# EAGLE board projectVGA (EAGLE 4.16), part 1 of 2
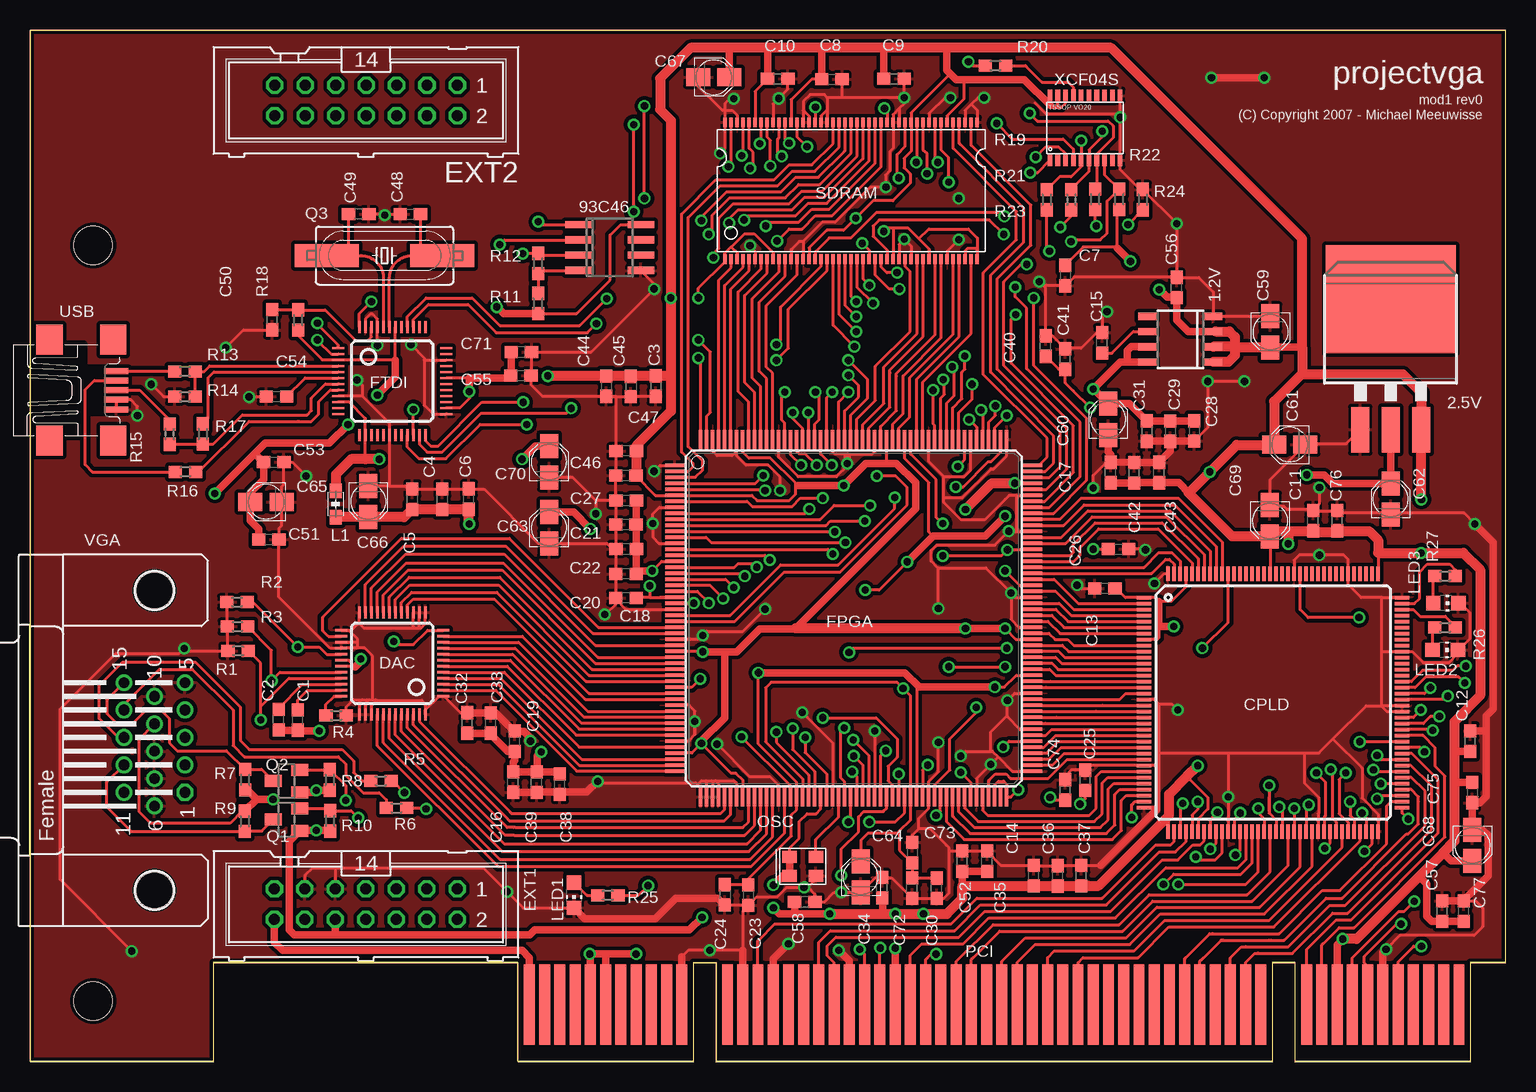
[diagram p5: board, top side]
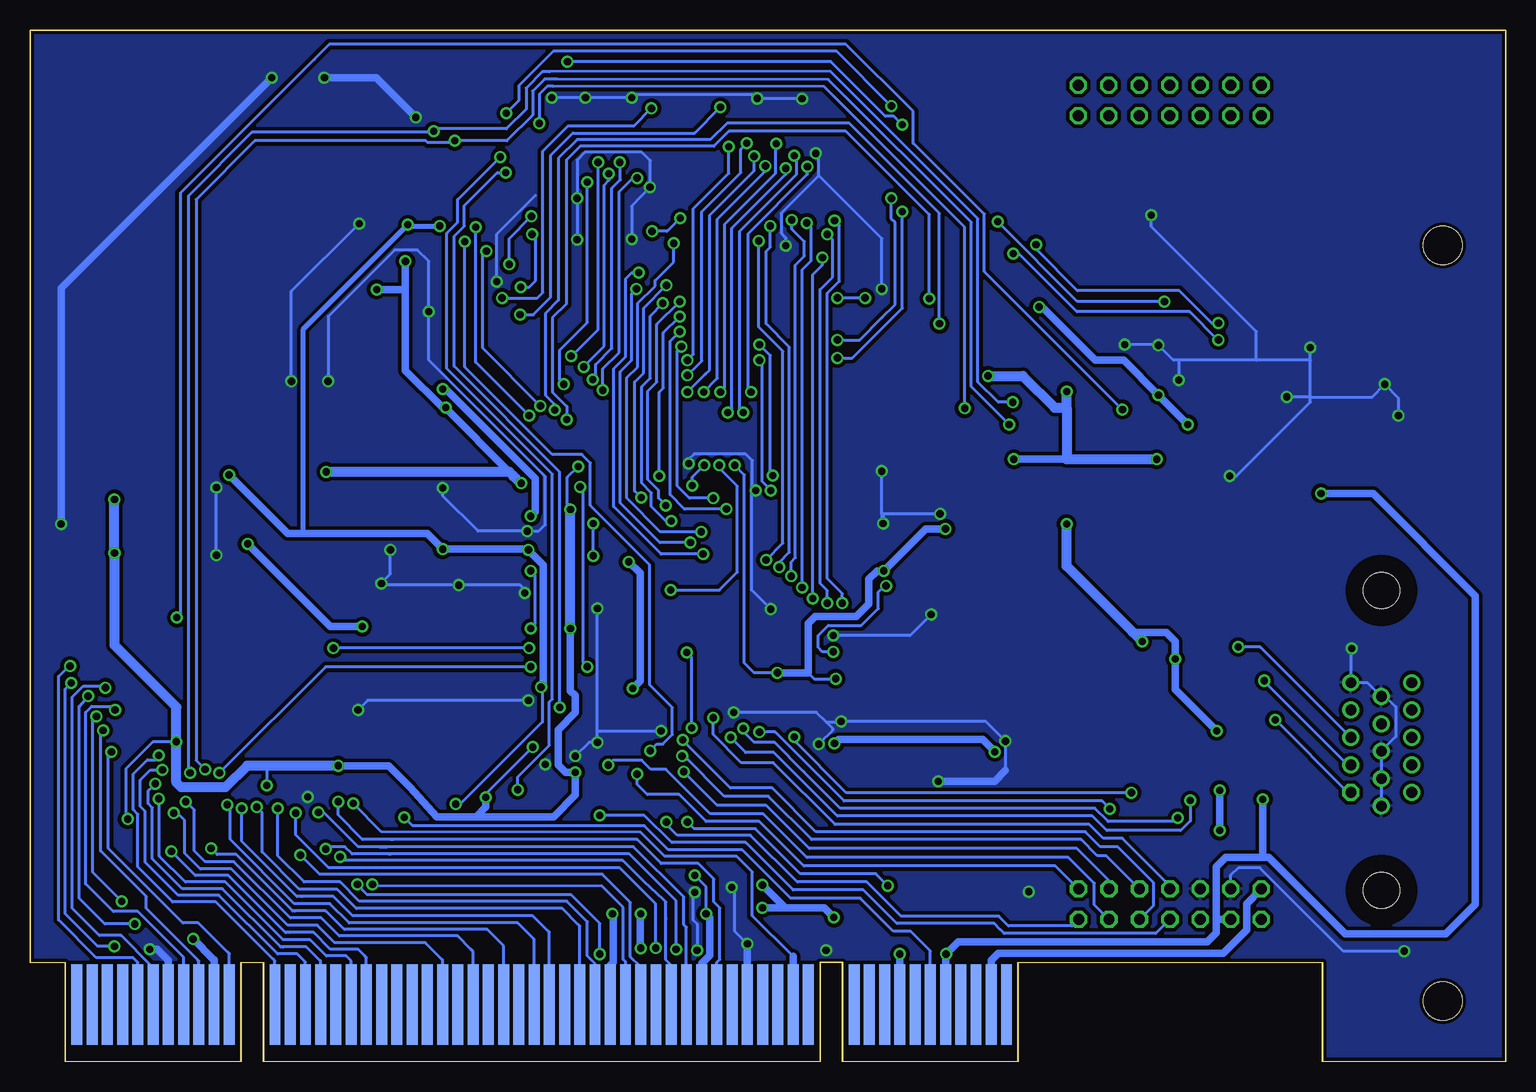
[diagram p6: board, bottom side, seen from below]

Size 122.99 x 86.04 mm. Coordinates in mm from the lower left corner, seen from the top.
Outline: 0,0 15.3,0 15.3,8.25 40.64,8.25 40.64,0 55.3,0 55.3,8.25 57.15,8.25 57.15,0 103.55,0 103.55,8.25 105.4,8.25 105.4,0 120.05,0 120.06,8.25 122.99,8.25 122.99,86.04 0,86.04 0,0
Copper layers (1*16): Top 0.035mm / dielectric 1.5mm / Bottom 0.035mm
Design rules "default": minimum track width 7mil, minimum drill 10mil, track to track 9mil, track to pad 8mil, pad to pad 8mil, via to via 9mil, smd to smd 0mil, copper to edge 10mil, drill to drill 8mil, minimum pad ring 10mil, minimum via ring 8mil, stop-mask expansion 4mil, vias tented up to drill 0mil, thermal gap 10mil

## Footprints (pad centres in the part's own frame; a part is rotated, then mirrored left to right if it is on the bottom)
SOIC8 = smd 0.6 x 1.5: 1 -1.905,-2.75; 2 -0.635,-2.75; 3 0.635,-2.75; 4 1.905,-2.75; 5 1.905,2.75; 6 0.635,2.75; 7 -0.635,2.75; 8 -1.905,2.75
TO263 = smd 1.524 x 3.81: 1 -2.54,-8.255; 2 0,-8.255; 3 2.54,-8.255 | smd 10.8 x 9: 4 0,2.635
SO-08 = smd 0.6 x 2.2: 1 -1.905,-2.6; 2 -0.635,-2.6; 3 0.635,-2.6; 4 1.905,-2.6; 5 1.905,2.6; 6 0.635,2.6; 7 -0.635,2.6; 8 -1.905,2.6
C0603 = smd 1.1 x 1: 1 -0.85,0; 2 0.85,0
PANASONIC_A = smd 2 x 1.5: + 1.3,0; - -1.3,0
TQ144 = smd 1.2 x 0.295: 1 -10.75,8.75; 2 -10.75,8.25; 3 -10.75,7.75; 4 -10.75,7.25; 5 -10.75,6.75; 6 -10.75,6.25; 7 -10.75,5.75; 8 -10.75,5.25; 9 -10.75,4.75; 10 -10.75,4.25; 11 -10.75,3.75; 12 -10.75,3.25; 13 -10.75,2.75; 14 -10.75,2.25; 15 -10.75,1.75; 16 -10.75,1.25; 17 -10.75,0.75; 18 -10.75,0.25; 19 -10.75,-0.25; 20 -10.75,-0.75; 21 -10.75,-1.25; 22 -10.75,-1.75; 23 -10.75,-2.25; 24 -10.75,-2.75; 25 -10.75,-3.25; 26 -10.75,-3.75; 27 -10.75,-4.25; 28 -10.75,-4.75; 29 -10.75,-5.25; 30 -10.75,-5.75; 31 -10.75,-6.25; 32 -10.75,-6.75; 33 -10.75,-7.25; 34 -10.75,-7.75; 35 -10.75,-8.25; 36 -10.75,-8.75; 73 10.75,-8.75; 74 10.75,-8.25; 75 10.75,-7.75; 76 10.75,-7.25; 77 10.75,-6.75; 78 10.75,-6.25; 79 10.75,-5.75; 80 10.75,-5.25; 81 10.75,-4.75; 82 10.75,-4.25; 83 10.75,-3.75; 84 10.75,-3.25; 85 10.75,-2.75; 86 10.75,-2.25; 87 10.75,-1.75; 88 10.75,-1.25; 89 10.75,-0.75; 90 10.75,-0.25; 91 10.75,0.25; 92 10.75,0.75; 93 10.75,1.25; 94 10.75,1.75; 95 10.75,2.25; 96 10.75,2.75; 97 10.75,3.25; 98 10.75,3.75; 99 10.75,4.25; 100 10.75,4.75; 101 10.75,5.25; 102 10.75,5.75; 103 10.75,6.25; 104 10.75,6.75; 105 10.75,7.25; 106 10.75,7.75; 107 10.75,8.25; 108 10.75,8.75 | smd 0.295 x 1.2: 37 -8.75,-10.75; 38 -8.25,-10.75; 39 -7.75,-10.75; 40 -7.25,-10.75; 41 -6.75,-10.75; 42 -6.25,-10.75; 43 -5.75,-10.75; 44 -5.25,-10.75; 45 -4.75,-10.75; 46 -4.25,-10.75; 47 -3.75,-10.75; 48 -3.25,-10.75; 49 -2.75,-10.75; 50 -2.25,-10.75; 51 -1.75,-10.75; 52 -1.25,-10.75; 53 -0.75,-10.75; 54 -0.25,-10.75; 55 0.25,-10.75; 56 0.75,-10.75; 57 1.25,-10.75; 58 1.75,-10.75; 59 2.25,-10.75; 60 2.75,-10.75; 61 3.25,-10.75; 62 3.75,-10.75; 63 4.25,-10.75; 64 4.75,-10.75; 65 5.25,-10.75; 66 5.75,-10.75; 67 6.25,-10.75; 68 6.75,-10.75; 69 7.25,-10.75; 70 7.75,-10.75; 71 8.25,-10.75; 72 8.75,-10.75; 109 8.75,10.75; 110 8.25,10.75; 111 7.75,10.75; 112 7.25,10.75; 113 6.75,10.75; 114 6.25,10.75; 115 5.75,10.75; 116 5.25,10.75; 117 4.75,10.75; 118 4.25,10.75; 119 3.75,10.75; 120 3.25,10.75; 121 2.75,10.75; 122 2.25,10.75; 123 1.75,10.75; 124 1.25,10.75; 125 0.75,10.75; 126 0.25,10.75; 127 -0.25,10.75; 128 -0.75,10.75; 129 -1.25,10.75; 130 -1.75,10.75; 131 -2.25,10.75; 132 -2.75,10.75; 133 -3.25,10.75; 134 -3.75,10.75; 135 -4.25,10.75; 136 -4.75,10.75; 137 -5.25,10.75; 138 -5.75,10.75; 139 -6.25,10.75; 140 -6.75,10.75; 141 -7.25,10.75; 142 -7.75,10.75; 143 -8.25,10.75; 144 -8.75,10.75
LQFP48 = smd 1 x 0.2: 1 -4.25,2.75; 2 -4.25,2.25; 3 -4.25,1.75; 4 -4.25,1.25; 5 -4.25,0.75; 6 -4.25,0.25; 7 -4.25,-0.25; 8 -4.25,-0.75; 9 -4.25,-1.25; 10 -4.25,-1.75; 11 -4.25,-2.25; 12 -4.25,-2.75; 25 4.25,-2.75; 26 4.25,-2.25; 27 4.25,-1.75; 28 4.25,-1.25; 29 4.25,-0.75; 30 4.25,-0.25; 31 4.25,0.25; 32 4.25,0.75; 33 4.25,1.25; 34 4.25,1.75; 35 4.25,2.25; 36 4.25,2.75 | smd 0.2 x 1: 13 -2.75,-4.25; 14 -2.25,-4.25; 15 -1.75,-4.25; 16 -1.25,-4.25; 17 -0.75,-4.25; 18 -0.25,-4.25; 19 0.25,-4.25; 20 0.75,-4.25; 21 1.25,-4.25; 22 1.75,-4.25; 23 2.25,-4.25; 24 2.75,-4.25; 37 2.75,4.25; 38 2.25,4.25; 39 1.75,4.25; 40 1.25,4.25; 41 0.75,4.25; 42 0.25,4.25; 43 -0.25,4.25; 44 -0.75,4.25; 45 -1.25,4.25; 46 -1.75,4.25; 47 -2.25,4.25; 48 -2.75,4.25
ML14 = drill 0.914 octagon: 1 -7.62,-1.27; 2 -7.62,1.27; 3 -5.08,-1.27; 4 -5.08,1.27; 5 -2.54,-1.27; 6 -2.54,1.27; 7 0,-1.27; 8 0,1.27; 9 2.54,-1.27; 10 2.54,1.27; 11 5.08,-1.27; 12 5.08,1.27; 13 7.62,-1.27; 14 7.62,1.27
PQ208 = smd 1.6 x 0.295: P1 -14.9,12.75; P2 -14.9,12.25; P3 -14.9,11.75; P4 -14.9,11.25; P5 -14.9,10.75; P6 -14.9,10.25; P7 -14.9,9.75; P8 -14.9,9.25; P9 -14.9,8.75; P10 -14.9,8.25; P11 -14.9,7.75; P12 -14.9,7.25; P13 -14.9,6.75; P14 -14.9,6.25; P15 -14.9,5.75; P16 -14.9,5.25; P17 -14.9,4.75; P18 -14.9,4.25; P19 -14.9,3.75; P20 -14.9,3.25; P21 -14.9,2.75; P22 -14.9,2.25; P23 -14.9,1.75; P24 -14.9,1.25; P25 -14.9,0.75; P26 -14.9,0.25; P27 -14.9,-0.25; P28 -14.9,-0.75; P29 -14.9,-1.25; P30 -14.9,-1.75; P31 -14.9,-2.25; P32 -14.9,-2.75; P33 -14.9,-3.25; P34 -14.9,-3.75; P35 -14.9,-4.25; P36 -14.9,-4.75; P37 -14.9,-5.25; P38 -14.9,-5.75; P39 -14.9,-6.25; P40 -14.9,-6.75; P41 -14.9,-7.25; P42 -14.9,-7.75; P43 -14.9,-8.25; P44 -14.9,-8.75; P45 -14.9,-9.25; P46 -14.9,-9.75; P47 -14.9,-10.25; P48 -14.9,-10.75; P49 -14.9,-11.25; P50 -14.9,-11.75; P51 -14.9,-12.25; P52 -14.9,-12.75; P105 14.9,-12.75; P106 14.9,-12.25; P107 14.9,-11.75; P108 14.9,-11.25; P109 14.9,-10.75; P110 14.9,-10.25; P111 14.9,-9.75; P112 14.9,-9.25; P113 14.9,-8.75; P114 14.9,-8.25; P115 14.9,-7.75; P116 14.9,-7.25; P117 14.9,-6.75; P118 14.9,-6.25; P119 14.9,-5.75; P120 14.9,-5.25; P121 14.9,-4.75; P122 14.9,-4.25; P123 14.9,-3.75; P124 14.9,-3.25; P125 14.9,-2.75; P126 14.9,-2.25; P127 14.9,-1.75; P128 14.9,-1.25; P129 14.9,-0.75; P130 14.9,-0.25; P131 14.9,0.25; P132 14.9,0.75; P133 14.9,1.25; P134 14.9,1.75; P135 14.9,2.25; P136 14.9,2.75; P137 14.9,3.25; P138 14.9,3.75; P139 14.9,4.25; P140 14.9,4.75; P141 14.9,5.25; P142 14.9,5.75; P143 14.9,6.25; P144 14.9,6.75; P145 14.9,7.25; P146 14.9,7.75; P147 14.9,8.25; P148 14.9,8.75; P149 14.9,9.25; P150 14.9,9.75; P151 14.9,10.25; P152 14.9,10.75; P153 14.9,11.25; P154 14.9,11.75; P155 14.9,12.25; P156 14.9,12.75 | smd 0.295 x 1.6: P53 -12.75,-14.9; P54 -12.25,-14.9; P55 -11.75,-14.9; P56 -11.25,-14.9; P57 -10.75,-14.9; P58 -10.25,-14.9; P59 -9.75,-14.9; P60 -9.25,-14.9; P61 -8.75,-14.9; P62 -8.25,-14.9; P63 -7.75,-14.9; P64 -7.25,-14.9; P65 -6.75,-14.9; P66 -6.25,-14.9; P67 -5.75,-14.9; P68 -5.25,-14.9; P69 -4.75,-14.9; P70 -4.25,-14.9; P71 -3.75,-14.9; P72 -3.25,-14.9; P73 -2.75,-14.9; P74 -2.25,-14.9; P75 -1.75,-14.9; P76 -1.25,-14.9; P77 -0.75,-14.9; P78 -0.25,-14.9; P79 0.25,-14.9; P80 0.75,-14.9; P81 1.25,-14.9; P82 1.75,-14.9; P83 2.25,-14.9; P84 2.75,-14.9; P85 3.25,-14.9; P86 3.75,-14.9; P87 4.25,-14.9; P88 4.75,-14.9; P89 5.25,-14.9; P90 5.75,-14.9; P91 6.25,-14.9; P92 6.75,-14.9; P93 7.25,-14.9; P94 7.75,-14.9; P95 8.25,-14.9; P96 8.75,-14.9; P97 9.25,-14.9; P98 9.75,-14.9; P99 10.25,-14.9; P100 10.75,-14.9; P101 11.25,-14.9; P102 11.75,-14.9; P103 12.25,-14.9; P104 12.75,-14.9; P157 12.75,14.9; P158 12.25,14.9; P159 11.75,14.9; P160 11.25,14.9; P161 10.75,14.9; P162 10.25,14.9; P163 9.75,14.9; P164 9.25,14.9; P165 8.75,14.9; P166 8.25,14.9; P167 7.75,14.9; P168 7.25,14.9; P169 6.75,14.9; P170 6.25,14.9; P171 5.75,14.9; P172 5.25,14.9; P173 4.75,14.9; P174 4.25,14.9; P175 3.75,14.9; P176 3.25,14.9; P177 2.75,14.9; P178 2.25,14.9; P179 1.75,14.9; P180 1.25,14.9; P181 0.75,14.9; P182 0.25,14.9; P183 -0.25,14.9; P184 -0.75,14.9; P185 -1.25,14.9; P186 -1.75,14.9; P187 -2.25,14.9; P188 -2.75,14.9; P189 -3.25,14.9; P190 -3.75,14.9; P191 -4.25,14.9; P192 -4.75,14.9; P193 -5.25,14.9; P194 -5.75,14.9; P195 -6.25,14.9; P196 -6.75,14.9; P197 -7.25,14.9; P198 -7.75,14.9; P199 -8.25,14.9; P200 -8.75,14.9; P201 -9.25,14.9; P202 -9.75,14.9; P203 -10.25,14.9; P204 -10.75,14.9; P205 -11.25,14.9; P206 -11.75,14.9; P207 -12.25,14.9; P208 -12.75,14.9
LQFP48' = smd 0.2 x 1: 1 -2.75,-4.5; 2 -2.25,-4.5; 3 -1.75,-4.5; 4 -1.25,-4.5; 5 -0.75,-4.5; 6 -0.25,-4.5; 7 0.25,-4.5; 8 0.75,-4.5; 9 1.25,-4.5; 10 1.75,-4.5; 11 2.25,-4.5; 12 2.75,-4.5; 25 2.75,4.5; 26 2.25,4.5; 27 1.75,4.5; 28 1.25,4.5; 29 0.75,4.5; 30 0.25,4.5; 31 -0.25,4.5; 32 -0.75,4.5; 33 -1.25,4.5; 34 -1.75,4.5; 35 -2.25,4.5; 36 -2.75,4.5 | smd 1 x 0.2: 13 4.5,-2.75; 14 4.5,-2.25; 15 4.5,-1.75; 16 4.5,-1.25; 17 4.5,-0.75; 18 4.5,-0.25; 19 4.5,0.25; 20 4.5,0.75; 21 4.5,1.25; 22 4.5,1.75; 23 4.5,2.25; 24 4.5,2.75; 37 -4.5,2.75; 38 -4.5,2.25; 39 -4.5,1.75; 40 -4.5,1.25; 41 -4.5,0.75; 42 -4.5,0.25; 43 -4.5,-0.25; 44 -4.5,-0.75; 45 -4.5,-1.25; 46 -4.5,-1.75; 47 -4.5,-2.25; 48 -4.5,-2.75
0805 = smd 1.2 x 1: 1 -1.1,0; 2 1.1,0
CHIP-LED0805 = smd 1.2 x 1.2: A 0,-1.05; C 0,1.05
ASE = smd 1.2 x 1: GND 1,-0.8; OE -1.2,-0.8; OUT 1,0.8; VDD -1.2,0.8
PCI_BRDL = smd 0.91 x 6.7: C1 41.593,4.763; C2 42.862,4.763; C3 44.133,4.763; C4 45.403,4.763; C5 46.672,4.763; C6 47.943,4.763; C7 49.212,4.763; C8 50.483,4.763; C9 51.752,4.763; C10 53.023,4.763; C11 54.292,4.763; C14 58.102,4.763; C15 59.373,4.763; C16 60.642,4.763; C17 61.913,4.763; C18 63.182,4.763; C19 64.453,4.763; C20 65.722,4.763; C21 66.993,4.763; C22 68.263,4.763; C23 69.532,4.763; C24 70.802,4.763; C25 72.073,4.763; C26 73.343,4.763; C27 74.612,4.763; C28 75.882,4.763; C29 77.153,4.763; C30 78.422,4.763; C31 79.692,4.763; C32 80.963,4.763; C33 82.233,4.763; C34 83.502,4.763; C35 84.772,4.763; C36 86.043,4.763; C37 87.312,4.763; C38 88.582,4.763; C39 89.853,4.763; C40 91.123,4.763; C41 92.392,4.763; C42 93.662,4.763; C43 94.933,4.763; C44 96.203,4.763; C45 97.472,4.763; C46 98.743,4.763; C47 100.013,4.763; C48 101.282,4.763; C49 102.552,4.763; C52 106.362,4.763; C53 107.632,4.763; C54 108.903,4.763; C55 110.172,4.763; C56 111.442,4.763; C57 112.713,4.763; C58 113.983,4.763; C59 115.252,4.763; C60 116.522,4.763; C61 117.793,4.763; C62 119.062,4.763 | smd 0.91 x 6.7 bottom: S1 41.593,4.763; S2 42.862,4.763; S3 44.133,4.763; S4 45.403,4.763; S5 46.672,4.763; S6 47.943,4.763; S7 49.212,4.763; S8 50.483,4.763; S9 51.752,4.763; S10 53.023,4.763; S11 54.292,4.763; S14 58.102,4.763; S15 59.373,4.763; S16 60.642,4.763; S17 61.913,4.763; S18 63.182,4.763; S19 64.453,4.763; S20 65.722,4.763; S21 66.993,4.763; S22 68.263,4.763; S23 69.532,4.763; S24 70.802,4.763; S25 72.073,4.763; S26 73.343,4.763; S27 74.612,4.763; S28 75.882,4.763; S29 77.153,4.763; S30 78.422,4.763; S31 79.692,4.763; S32 80.963,4.763; S33 82.233,4.763; S34 83.502,4.763; S35 84.772,4.763; S36 86.043,4.763; S37 87.312,4.763; S38 88.582,4.763; S39 89.853,4.763; S40 91.123,4.763; S41 92.392,4.763; S42 93.662,4.763; S43 94.933,4.763; S44 96.203,4.763; S45 97.472,4.763; S46 98.743,4.763; S47 100.013,4.763; S48 101.282,4.763; S49 102.552,4.763; S52 106.362,4.763; S53 107.632,4.763; S54 108.903,4.763; S55 110.172,4.763; S56 111.442,4.763; S57 112.713,4.763; S58 113.983,4.763; S59 115.252,4.763; S60 116.522,4.763; S61 117.793,4.763; S62 119.062,4.763 | hole 3.2: 5.24,5.05; 5.24,68.05
SOT23 = smd 1 x 1.4: 1 -0.95,-1.1; 2 0.95,-1.1; 3 0,1.1
HC49UP = smd 5.334 x 1.93: 1 -4.826,0; 2 4.826,0
R0603 = smd 1.1 x 1: 1 -0.85,0; 2 0.85,0
86TSOP = smd 0.295 x 0.813: P$1 -10.5,-5.7; P$2 -10,-5.7; P$3 -9.5,-5.7; P$4 -9,-5.7; P$5 -8.5,-5.7; P$6 -8,-5.7; P$7 -7.5,-5.7; P$8 -7,-5.7; P$9 -6.5,-5.7; P$10 -6,-5.7; P$11 -5.5,-5.7; P$12 -5,-5.7; P$13 -4.5,-5.7; P$14 -4,-5.7; P$15 -3.5,-5.7; P$16 -3,-5.7; P$17 -2.5,-5.7; P$18 -2,-5.7; P$19 -1.5,-5.7; P$20 -1,-5.7; P$21 -0.5,-5.7; P$22 0,-5.7; P$23 0.5,-5.7; P$24 1,-5.7; P$25 1.5,-5.7; P$26 2,-5.7; P$27 2.5,-5.7; P$28 3,-5.7; P$29 3.5,-5.7; P$30 4,-5.7; P$31 4.5,-5.7; P$32 5,-5.7; P$33 5.5,-5.7; P$34 6,-5.7; P$35 6.5,-5.7; P$36 7,-5.7; P$37 7.5,-5.7; P$38 8,-5.7; P$39 8.5,-5.7; P$40 9,-5.7; P$41 9.5,-5.7; P$42 10,-5.7; P$43 10.5,-5.7; P$44 10.5,5.7; P$45 10,5.7; P$46 9.5,5.7; P$47 9,5.7; P$48 8.5,5.7; P$49 8,5.7; P$50 7.5,5.7; P$51 7,5.7; P$52 6.5,5.7; P$53 6,5.7; P$54 5.5,5.7; P$55 5,5.7; P$56 4.5,5.7; P$57 4,5.7; P$58 3.5,5.7; P$59 3,5.7; P$60 2.5,5.7; P$61 2,5.7; P$62 1.5,5.7; P$63 1,5.7; P$64 0.5,5.7; P$65 0,5.7; P$66 -0.5,5.7; P$67 -1,5.7; P$68 -1.5,5.7; P$69 -2,5.7; P$70 -2.5,5.7; P$71 -3,5.7; P$72 -3.5,5.7; P$73 -4,5.7; P$74 -4.5,5.7; P$75 -5,5.7; P$76 -5.5,5.7; P$77 -6,5.7; P$78 -6.5,5.7; P$79 -7,5.7; P$80 -7.5,5.7; P$81 -8,5.7; P$82 -8.5,5.7; P$83 -9,5.7; P$84 -9.5,5.7; P$85 -10,5.7; P$86 -10.5,5.7
UX60A-MB-5ST = smd 2 x 0.5: 1 2.25,1.6; 2 2.25,0.8; 3 2.25,0; 4 2.25,-0.8; 5 2.25,-1.6 | smd 2.2 x 2.5: M1 -3.3,-4.2; M2 -3.3,4.2; M3 2,4.2; M4 2,-4.2
HDF15H = drill 0.9 octagon: 1 4.329,2.54 | drill 0.9 round: 2 2.043,2.54; 3 -0.243,2.54; 4 -2.529,2.54; 5 -4.815,2.54; 6 5.472,0; 7 3.186,0; 8 0.9,0; 9 -1.386,0; 10 -3.672,0; 11 4.329,-2.54; 12 2.043,-2.54; 13 -0.243,-2.54; 14 -2.529,-2.54; 15 -4.815,-2.54 | hole 3: -12.5,0; 12.5,0
VO20 = smd 0.381 x 1.003: 1 2.928,2.701; 2 2.276,2.7; 3 1.626,2.7; 4 0.977,2.701; 5 0.325,2.7; 6 -0.325,2.7; 7 -0.975,2.7; 8 -1.626,2.7; 9 -2.276,2.7; 10 -2.926,2.7; 11 -2.928,-2.7; 12 -2.28,-2.7; 13 -1.623,-2.7; 14 -0.975,-2.7; 15 -0.328,-2.7; 16 0.328,-2.7; 17 0.975,-2.71; 18 1.623,-2.7; 19 2.28,-2.7; 20 2.928,-2.7

## Placement (x,y rotation side)
1.2V  MCP1726  [SOIC8]  95.86,60.26 90 top
2.5V  LM1086TO263  [TO263]  113.39,60.96 0 top
93C46  93-C46BSN  [SO-08]  48.31,67.9 270 top
C1  100n  [C0603]  22.31,28.51 90 top
C2  100n  [C0603]  20.71,28.53 90 top
C3  10n  [C0603]  52.14,56.35 270 top
C4  100n  [C0603]  34.37,46.91 90 top
C5  100n  [C0603]  31.87,46.91 90 top
C6  10n  [C0603]  36.57,46.93 90 top
C7  10n  [C0603]  86.25,65.56 270 top
C8  100n  [C0603]  66.82,81.93 0 top
C9  10n  [C0603]  71.99,81.98 0 top
C10  10n  [C0603]  62.31,81.98 0 top
C11  10n  [C0603]  106.92,45.13 90 top
C12  10n  [C0603]  120.02,26.75 90 top
C13  100n  [C0603]  89.57,39.48 180 top
C14  10n  [C0603]  83.65,15.54 90 top
C15  1n  [C0603]  89.33,59.95 90 top
C16  10n  [C0603]  40.25,23.34 90 top
C17  10n  [C0603]  90.05,49.14 90 top
C18  10n  [C0603]  49.66,38.7 180 top
C19  10n  [C0603]  40.4,26.74 90 top
C20  10n  [C0603]  49.67,40.7 180 top
C21  10n  [C0603]  49.65,44.8 180 top
C22  10n  [C0603]  49.68,42.75 180 top
C23  10n  [C0603]  59.85,13.91 270 top
C24  10n  [C0603]  57.9,13.94 270 top
C25  10n  [C0603]  87.95,23.48 90 top
C26  10n  [C0603]  90.7,42.75 0 top
C27  10n  [C0603]  49.68,46.8 180 top
C28  10n  [C0603]  97,52.61 270 top
C29  10n  [C0603]  95,52.59 270 top
C30  100n  [C0603]  75.55,14.48 90 top
C31  100n  [C0603]  93.05,52.6 270 top
C32  10n  [C0603]  36.45,28.27 90 top
C33  10n  [C0603]  38.41,28.26 90 top
C34  10n  [C0603]  71.01,14.53 90 top
C35  10n  [C0603]  79.76,16.75 90 top
C36  10n  [C0603]  85.66,15.52 90 top
C37  10n  [C0603]  87.61,15.54 90 top
C38  10n  [C0603]  44.16,23.16 90 top
C39  10n  [C0603]  42.21,23.33 90 top
C40  10n  [C0603]  84.63,59.68 90 top
C41  100n  [C0603]  86.28,58.6 90 top
C42  10n  [C0603]  92.03,49.12 90 top
C43  100n  [C0603]  94.08,49.14 90 top
C44  10n  [C0603]  48.02,56.34 270 top
C45  100n  [C0603]  50.07,56.32 270 top
C46  10n  [C0603]  49.65,48.88 180 top
C47  100n  [C0603]  49.68,50.93 180 top
C48  27p  [C0603]  31.69,70.67 0 top
C49  27p  [C0603]  27.39,70.68 180 top
C50  100n  [C0603]  20.18,61.88 90 top
C51  100n  [C0603]  19.9,43.57 0 top
C52  10n  [C0603]  77.7,16.74 90 top
C53  100n  [C0603]  20.31,50.01 0 top
C54  33n  [C0603]  20.53,55.46 0 top
C55  100n  [C0603]  40.9,57.21 0 top
C56  100n  [C0603]  95.54,64.57 90 top
C57  10n  [C0603]  117.68,12.58 90 top
C58  10n  [C0603]  64.56,13.36 0 top
C59  10u  [PANASONIC_A]  103.37,60.87 270 top
C60  10u  [PANASONIC_A]  89.85,53.58 90 top
C61  10u  [PANASONIC_A]  104.97,51.47 180 top
C62  10u  [PANASONIC_A]  113.39,46.93 90 top
C63  10u  [PANASONIC_A]  43.26,44.53 90 top
C64  10u  [PANASONIC_A]  69.23,15.43 90 top
C65  10u  [PANASONIC_A]  19.67,46.7 180 top
C66  10u  [PANASONIC_A]  28.18,46.72 270 top
C67  10u  [PANASONIC_A]  56.98,82.11 0 top
C68  10u  [PANASONIC_A]  120.19,18.07 270 top
C69  10u  [PANASONIC_A]  103.32,45.12 270 top
C70  10u  [PANASONIC_A]  43.25,50.03 90 top
C71  100n  [C0603]  40.94,59.2 0 top
C72  10n  [C0603]  73.5,14.49 90 top
C73  10n  [C0603]  73.5,17.46 270 top
C74  10n  [C0603]  86.28,22.68 90 top
C75  100n  [C0603]  120.17,22.47 270 top
C76  100n  [C0603]  108.93,45.13 90 top
C77  100n  [C0603]  119.48,12.58 90 top
CPLD  XC95144XL  [TQ144]  103.59,29.97 0 top
DAC  FMS3818  [LQFP48]  30.19,33.23 180 top
EXT1  [ML14]  27.99,13.15 180 top
EXT2  [ML14]  28,80.16 180 top
FPGA  XC3S400PQ208  [PQ208]  68.63,36.99 0 top
FTDI  FTDI2232L  [LQFP48']  30.2,56.77 270 top
L1  [0805]  25.49,46.52 90 top
LED1  [CHIP-LED0805]  45.34,13.9 180 top
LED2  [CHIP-LED0805]  117.93,34.35 270 top
LED3  [CHIP-LED0805]  117.98,38.25 270 top
OSC  50MHZ  [ASE]  64.49,16.32 0 top
PCI  PCI_CON  [PCI_BRDL]  0.02,0.04 0 top
Q1  BSS123  [SOT23]  21.37,20.21 90 top
Q2  BSS123  [SOT23]  21.37,23.42 90 top
Q3  [HC49UP]  29.54,67.23 180 top
R1  75R  [R0603]  17.35,34.28 0 top
R2  75R  [R0603]  17.25,38.34 0 top
R3  75R  [R0603]  17.3,36.3 0 top
R4  348  [R0603]  25.51,28.89 180 top
R5  82R5  [R0603]  29.24,23.42 0 top
R6  82R5  [R0603]  30.54,21.17 0 top
R7  10K  [R0603]  17.93,23.53 90 top
R8  10K  [R0603]  24.99,23.52 90 top
R9  10K  [R0603]  17.91,20.07 90 top
R10  10K  [R0603]  25,20.1 270 top
R11  10K  [R0603]  42.33,63.23 270 top
R12  2K2  [R0603]  42.33,66.57 270 top
R13  4K7  [R0603]  12.91,57.57 180 top
R14  10K  [R0603]  12.91,55.46 0 top
R15  27R  [R0603]  11.63,52.34 270 top
R16  27R  [R0603]  12.96,49.19 0 top
R17  1K5  [R0603]  14.4,52.36 90 top
R18  470R  [R0603]  22.34,61.86 90 top
R19  68R  [R0603]  84.73,71.88 270 top
R20  68R  [R0603]  80.45,83.06 180 top
R21  68R  [R0603]  86.77,71.88 270 top
R22  4K7  [R0603]  90.75,71.92 270 top
R23  4K7  [R0603]  88.76,71.92 270 top
R24  82R5  [R0603]  92.74,71.89 90 top
R25  68R  [R0603]  48.15,13.9 0 top
R26  68R  [R0603]  117.92,36.21 0 top
R27  68R  [R0603]  117.92,40.51 0 top
SDRAM  MT48LC4M32B2  [86TSOP]  68.43,72.63 0 top
USB  MINI-USB-UX60A-MB-5ST  [UX60A-MB-5ST]  4.93,56.01 0 top
VGA  [HDF15H]  10.37,26.81 270 top
XCF04S  XCF04S-VO20  [VO20]  87.92,77.87 180 top

## Tracks (layer width: path | path; a pad name or v marks a point on that pad's centre or on a via)
1V2  (via drill 0.6)
  Top 0.254: FPGA.P192 63.88,50.92 64.1,50.7 64.6,50.7 v65.55,49.75 | C60.+ 89.85,54.9 | 91.45,58.36 91.45,58.35 | C28.1 | C29.1 | FPGA.P70 64.38,23.62 61.3,26.7 61.3,31.2 61.75,31.65 72.25,31.65 v72.75,31.15 73.38,30.52 FPGA.P88 73.38,20.18 72.45,19.25 | FPGA.P174 72.88,50.32 74.9,48.3 74.9,44.2 75.25,43.85 | C30.2 73.52,15.33 C72.2 C73.2 | C73.2 | v73.1,41.7 70.75,39.35 v69.6,39.35 | 72.45,19.25 72.3,19.1 69.85,19.1 69.25,18.5 69.25,16.75 C64.+ | C73.2 72.45,17.66 72.45,19.25
  Top 0.61: 1.2V.7 91.78,59.63 91.45,59.3 91.45,58.36 | 91.45,58.36 1.2V.8 | v81.25,45.5 79.6,43.85 75.25,43.85 v73.1,41.7 | C28.1 95.15,53.45 95.14,53.44 C29.1 C31.1 91.62,54.88 C60.+ 88.6,56.13 v88.6,56.1 90.86,58.36 91.45,58.36
  Bottom 0.254: v65.55,49.75 65.55,49.5 64.05,48 64.05,40.85 65.55,39.35 v69.6,39.35
  Bottom 0.61: 81.05,45.7 v81.25,45.5 80.9,45.85 80.9,48.65 88.35,56.1 v88.6,56.1 | v73.1,41.7 72.15,40.75 72.15,31.75 v72.75,31.15
2V5  (via drill 0.6)
  Top 0.254: 113.25,48.1 C62.+ | 59.94,14.79 59.91,14.76 C23.1 59.9,14.81 59.9,15.3 63.45,18.85 63.45,20.6 63.88,21.03 FPGA.P69 63.88,23.32 60.7,26.5 v60.7,32.45 | C24.1 59.94,14.79 | 59.94,14.79 59.95,14.8 | FPGA.P17 52.64,41.74 v51.85,40.95 | C20.1 50.55,40.7 50.8,40.95 | 50.52,42.72 50.55,42.75 C22.1 50.53,42.77 50.5,42.8 | FPGA.P38 55.14,31.24 v55.85,31.95 | C25.1 87.95,21.95 v87.5,21.5 | FPGA.P193 63.38,50.62 v64.25,49.75 | C21.1 50.53,44.83 | v88.6,42.75 C26.1 | v91.5,69.8 R24.1 | R23.2 88.76,69.79 v88.85,69.7 | FPGA.P121 82.19,32.24 81.2,31.25 v80.4,31.25 | FPGA.P173 73.38,50.67 75.5,48.55 75.5,45.4 v76.05,44.9 | FPGA.P89 73.88,31.28 74.1,31.25 | v76.05,42.2 80.95,42.2 v81.45,42.7 81.49,42.74 FPGA.P142
  Top 0.61: v51.85,40.95 50.8,40.95 | C20.1 50.52,42.72 | 50.5,42.8 C21.1 | 50.53,44.83 C27.1 | v60.7,32.45 72.9,32.45 74.1,31.25 v80.4,31.25 | C62.+ 108.57,48.23 107.85,48.95 v106.4,48.95 | C62.+ | C63.+ 45.32,45.83 v46.7,44.45 | 113.4,52.72 113.4,52.75 | 113.4,52.72 2.5V.2 | C62.+ 113.4,48.25 113.4,52.72
  Bottom 0.254: 51.9,40.95 v51.85,40.95 51.95,40.85 | v60.7,32.45 60.75,32.45 | v60.7,32.45 60.15,32.45 | v64.25,49.75 63.45,48.95 63.45,33.25 62.65,32.45 v60.7,32.45 | v55.85,31.95 57.65,31.95 58.15,32.45 | v76.05,42.2 v76.05,44.9 | v87.5,21.5 87.15,21.5 80.3,28.35 80.3,31.55 v80.4,31.25
  Bottom 0.406: v88.85,69.7 91.4,69.7 v91.5,69.8 100.2,61.1 100.2,44.05 100.2,44 | 99.25,44.05 99.25,43.95
  Bottom 0.61: v46.7,44.45 48.35,44.45 v51.85,40.95 | v60.7,32.45 58.15,32.45 58.15,36.55 57.55,37.15 54.15,37.15 53.1,38.2 53.1,40.25 52.4,40.95 51.9,40.95 | v106.4,48.95 101.5,44.05 100.2,44.05 99.25,44.05 89.9,44.05 v88.6,42.75 81.5,42.75 v81.45,42.7 80.2,41.45 80.2,31.45 v80.4,31.25
3V3  (via drill 0.6, 0.6 pad 0.25)
  Top 0.254: 58.45,67.95 58.4,67.95 57.9,67.45 57.9,67 SDRAM.P$1 57.93,66.73 55.7,64.5 v55.7,63.7 | 74.08,68.63 73.15,69.55 71.95,69.55 | 74.08,68.63 74.93,67.77 SDRAM.P$35 74.93,67.78 | SDRAM.P$41 77.93,67.63 78.1,67.8 78.85,67.8 78.95,67.7 | 78.95,67.7 78.93,67.68 SDRAM.P$43 | 78.95,67.7 78.95,68.7 78.2,69.45 74.9,69.45 74.08,68.63 | C57.1 117.48,11.73 117.5,11.75 117.52,11.73 | 103.25,20.9 103.25,22.1 | 94.05,36.3 94.05,35.35 94.06,35.35 | C69.+ 103.3,43.8 | 106.9,44.25 106.9,44.26 C11.1 107,44.2 | 103.7,44.2 103.75,44.25 | 109,44.2 109,44.21 C76.1 108.96,44.25 | C69.+ 103.27,43.82 103.25,43.8 103.2,43.85 | C61.+ 103.22,51.47 | C14.1 85.54,14.69 85.55,14.7 85.58,14.67 C36.1 87.47,14.67 87.55,14.75 C37.1 | C37.1 88.24,14.69 | 77.4,16.25 77.36,16.29 | 77.4,16.25 77.35,16.2 | OSC.VDD 63.3,17.1 63.29,17.09 | 77.7,14.65 77.7,14.7 77.71,14.69 | 24.87,22.65 R8.1 | FPGA.P60 59.38,23.52 58.83,24.07 58.83,24.08 58.8,24.1 58.4,24.1 v55.95,26.55 55.15,25.75 54.6,25.75 54.59,25.74 FPGA.P49 | 38.41,27.29 C33.1 | C32.1 36.52,27.42 36.55,27.45 36.59,27.41 | FPGA.P98 78.38,23.32 v77.55,24.15 | 77.7,15.7 77.6,15.9 77.61,15.89 C52.1 77.7,15.85 77.4,16.15 77.4,16.25 | C35.1 79.65,15.9 79.64,15.89 | FPGA.P110 81.59,26.74 v81.1,26.25 | 50.51,38.74 C18.1 | 51.65,38.74 50.51,38.74 | 51.65,38.74 FPGA.P23 52.51,38.74 | 50.51,38.74 50.5,38.75 | FPGA.P32 55.96,34.24 56,34.2 56.05,34.15 v56.05,34.2 | FPGA.P136 82.46,39.74 v81.25,40.95 | 103.22,59.38 103.15,59.45 103.27,59.57 C59.+ 103.23,59.57 103.2,59.6 | 98.8,60.9 1.2V.3 98.55,60.95 98.5,60.9 | 100.4,59.6 100.38,59.63 | 92.03,48.23 92,48.2 | 92.03,48.23 C42.1 | 92.09,48.29 92.03,48.23
  Top 0.254: C17.1 90.05,48.35 90.13,48.27 | 72.25,12.35 72.35,12.35 v72.1,12.35 | v66.65,12.35 66.85,12.35 | 88.15,14.7 88.14,14.69 C37.1 | FTDI.10 26.58,55.02 27.95,53.65 FTDI.14 | FTDI.14 27.95,52.25 | 27.95,50.25 FTDI.14 | FTDI.31 36.58,57.02 36.6,57 36.62,57.02 | 36.6,55.85 v36.6,55.9 36.6,55.3 35.82,54.52 FTDI.26 | C45.1 49.92,57.17 49.9,57.15 49.86,57.19 | 52.14,57.24 52.15,57.25 | 52.14,57.24 C3.1 | 52.14,57.24 52.07,57.17 | 50.47,48.88 50.35,49 | 50.47,48.88 C46.1 50.53,48.88 50.55,48.9 50.53,48.92 | 50.53,51.38 C47.1 | C40.1 85.71,57.75 C41.1 86.28,56.62 86.95,55.95 | 40.02,57.02 40.2,57.2 | 40.2,57.2 C55.1 | 40.2,57.2 40.09,57.21 | FPGA.P153 v82.06,48.24 v82.05,48.25 | 95.25,48.4 95.4,48.3 95.75,48.25 95.71,48.29 | v88.35,54.55 86.95,55.95 | 86.95,55.95 86.93,55.97 | 95.55,63.75 C56.1 | XCF04S.18 86.3,79.95 85.95,79.6 85.65,79.6 | 85.4,79.6 85.65,79.6 | 85.4,79.6 85.3,79.6 | XCF04S.19 85.64,79.61 85.65,79.6 | 85.4,79.6 85.15,79.6 85,79.75 85,79.76 XCF04S.20 | C7.1 86.25,66.45 87.75,67.95 90.6,67.95 | v115.95,46.9 115.93,46.92 | 106.01,57.35 106.45,57.35 | SDRAM.P$15 64.93,67.88 66.4,69.35 67.8,69.35 v68.8,70.35 70.25,71.8 71.9,71.8 73.35,73.25 73.35,74.05 72.85,74.55 72.85,75.35 73.43,75.93 SDRAM.P$55 73.43,79.13 76.7,82.4 | FPGA.P201 59.38,50.87 59.9,50.35 61.7,50.35 63.8,48.25 63.8,47.35 63.25,46.8 60.6,46.8 60.16,47.24 FPGA.P6 52.11,47.24 50.47,48.88 | FPGA.P164 77.88,50.23 v77.3,49.65 | 71.95,69.55 71.45,69.55 v71.15,69.25 | OSC.VDD 63.29,17.39 | SDRAM.P$29 71.93,69.53 71.95,69.55 | 94.06,35.35 | CPLD.8 93.93,35.22 94.06,35.35 | C13.1 90.52,39.48 91.28,38.72 CPLD.1 93.77,38.72 94.08,38.4 94.05,38.4 94.05,38.45 95.15,38.45 96.34,39.64 CPLD.141
  Top 0.254: CPLD.42 97.34,20.27 98.15,21.08 98.15,22.05 96.4,23.8 | FPGA.P84 71.38,21.14 71.12,20.88 69.48,20.88 69.05,20.45 69.05,19.2 67.6,17.75 v67.6,15.55 | C69.+ 103.32,43.79 103.34,43.77 | 58.45,67.95 58.45,67.94 58.93,67.46 SDRAM.P$3 | CPLD.109 112.34,42.47 112.37,42.47 112.39,42.45 | 103.25,20.9 103.25,20.75 103.84,20.16 CPLD.55 | C69.+ 103.33,43.84 103.34,43.82 CPLD.127 | CPLD.37 94.84,20.67 94.85,20.67 94.93,20.57 | 62.72,15.52 OSC.OE | R22.2 90.6,70.92 90.6,67.95 | v43.16,57.19 v43.15,57.2 | FPGA.P188 65.88,50.67 v66.8,49.75 | CPLD.73 114.34,20.76 v114.85,20.25 | 71.07,13.68 C34.1 | 71.4,49.9 71.4,49.95 71.38,49.97 FPGA.P177 | C69.+ 103.7,44.2 | 103.7,44.2 103.7,44.25 | v103.25,23.05 103.25,20.9 | v51.65,39.7 51.65,38.74 | FPGA.P127 82.16,35.24 v81.25,36.15 | 90.6,67.85 90.6,67.95 | CPLD.84 110.82,26.72 v110.8,26.7 | C74.1 85.22,21.83 v85,22.05 | FPGA.P73 65.88,21.08 65.5,20.7 64.75,20.7 64.1,20.05 64.1,18.65 63.29,17.84 OSC.VDD | C10.1 61.46,81.96 60.43,80.93 SDRAM.P$81 | 65.97,81.67 C8.1 65.13,81.93 63.43,80.23 SDRAM.P$75 | SDRAM.P$49 76.43,78.88 77.8,80.25 77.8,81.9 | 58.45,67.95 59.55,69.05 60.35,69.05 61.93,67.47 SDRAM.P$9 | 111.6,44.25
  Top 0.61: 117.52,11.73 C77.1 | C57.1 116.82,11.73 116.4,12.15 116.4,14.85 115.78,15.48 | 94.05,38.4 94.05,36.3 v95.3,36.3 | OSC.OE 63.29,17.09 | 38.41,27.29 39.81,25.89 C19.1 40.4,25.15 40.25,25 C16.2 40.27,24.18 C39.2 42.23,24.18 42.25,24.2 | C33.1 36.59,27.41 | 77.7,14.7 77.7,15.7 | C52.1 79.64,15.89 | C56.1 95.54,61.86 96.5,60.9 98.8,60.9 | 92.09,48.29 C43.1 95.71,48.29 | C42.1 90.13,48.27 | v36.6,55.9 36.6,57 | 36.62,57.02 40.02,57.02 | 40.09,57.21 C71.1 | 95.55,63.75 94.75,63.75 v94.1,64.4 | 96.55,47.45 95.75,48.25 | v61.95,14.75 62.72,15.52 | 63.7,12.35 62.45,12.35 v61.95,12.85 | 63.7,12.35 v66.65,12.35 | PCI.C54 108.93,9.77 v109.4,10.25 | C75.1 118.88,23.32 118.7,23.2 | 118.7,25.9 C12.1 | 71.07,13.68 71.07,12.38 71.1,12.35 | 63.7,12.35 63.7,12.4 63.71,12.41 C58.1 | 104.85,44.25 104.85,44.2 | 56,34.2 v56.05,34.2 57.9,34.2 | 57.9,34.2 57.9,28.7 55.95,26.75 v55.95,26.55 | v77.95,36.15 v81.25,36.15 | v56,12.05 54.95,11 42.05,11 41.65,10.6 25.45,10.6 | v42.6,25.86 v42.6,25.85 42.25,25.5 42.25,24.2 | C38.2 43.95,24.2 42.25,24.2 | 64,48.05 v67.8,48.05 69.65,49.9 71.4,49.9 72.2,49.9 73.8,48.3 73.8,46.15 63.8,36.15 64.1,36.1 60.8,36.1 58.9,34.2 57.9,34.2 | 25.45,10.6 EXT1.10 | 25.45,10.6 22,10.6 21.6,11 21.6,18.39 Q1.1 22.51,19.26 22.55,19.3 | 22.55,19.3 23.65,19.3 | 23.65,19.3 v23.85,19.3 | R10.2 24.8,19.3 23.65,19.3 | Q2.1 23.67,22.47 v23.85,22.65 24.87,22.65 | 22.55,19.3 22.51,19.3 | 106.05,59.6 106.01,59.6 103.4,59.6 103.2,59.6 | C68.+ 118.43,16.77 117.75,17.45 | v91.7,66.75 90.6,67.85 | C70.+ 42.08,51.33 v41,50.25 | C10.1 61.46,84.54 61.45,84.55 | 58.3,84.55 58.3,84.5 58.28,84.48 C67.+ | 65.95,84.55 65.95,84.5 65.97,84.48 C8.1
  Top 0.61: 71.15,84.55 71.15,84.5 71.14,84.49 C9.1 | 85,79.75 82.85,81.9 77.8,81.9 77.2,81.9 76.7,82.4 76.4,82.7 76.4,84.55 | PCI.C25 72.1,9.51 v72.1,9.49
  Top 0.813: 107,44.2 109,44.2 | 108.96,44.25 111.6,44.25 112.34,43.51 112.34,42.47 | C37.1 C14.1 77.71,14.69 | 77.7,14.65 77.7,13.65 76.4,12.35 v74.45,12.35 72.35,12.35 | 1.2V.1 99.86,58.36 100.4,58.9 100.4,59.6 | 100.4,59.6 100.4,60.45 99.95,60.9 98.8,60.9 | 100.38,59.63 1.2V.2 | v66.65,12.35 71.1,12.35 v72.1,12.35 | 88.15,14.7 89.05,14.7 94.93,20.57 94.93,22.32 96.4,23.8 v97.3,24.7 | L1.2 25.49,48.99 26.75,50.25 27.95,50.25 v29.1,50.25 | 49.86,57.19 C44.1 v43.16,57.19 | 52.07,57.17 C45.1 | C47.1 50.53,48.92 | 103.2,43.85 100.15,43.85 96.55,47.45 v98.3,49.2 100.55,51.45 103.65,51.45 | 115.93,46.92 2.5V.3 | 115.95,52.35 115.95,55.8 114.4,57.35 106.01,57.35 | v82.05,48.25 80.15,48.25 v77.95,46.05 | 106.9,44.25 104.85,44.25 103.7,44.25 | v109.4,10.25 110.55,10.25 115.78,15.48 117.75,17.45 118.7,18.4 118.7,23.2 118.7,25.9 118.7,28.35 120.85,30.55 120.85,41.05 119.45,42.45 112.39,42.45 | 104.85,44.2 v104.85,43.2 | 106.01,57.35 106.01,59.6 106.01,68.64 90.1,84.55 76.4,84.55 71.15,84.55 65.95,84.55 61.45,84.55 58.3,84.55 55.05,84.55 52.5,82 52.5,79.4 53.4,78.5 v53.4,63.7 53.4,57.2 | 53.4,57.2 53.4,54.25 50.53,51.38 | 53.4,57.2 C3.1 | 106.01,57.35 106,57.4 103.67,55.07 C61.+ | C59.+ 103.4,59.6 100.4,59.6 | v77.95,36.15 63.8,36.15
  Bottom 0.254: 81.15,26.25 v81.1,26.25 85,22.35 v85,22.05 | 56,34.2 v56.05,34.2 56.95,34.2 57.3,34.55 57.3,35.55 56.45,36.4 53.7,36.4 52.3,37.8 52.3,39.2 51.8,39.7 v51.65,39.7 | v81.25,40.95 80.9,40.6 80.9,36.5 v81.25,36.15 | 84.8,20.45 84.73,20.43 | v77.3,49.65 78.2,48.75 78.2,46.3 v77.95,46.05 | v53.4,63.7 v55.7,63.7 | v71.15,69.25 69.9,69.25 v68.8,70.35 | 107.65,8.5 107.7,8.55 107.66,8.5 | v66.65,12.35 66.65,14.6 v67.6,15.55 | v114.85,20.25 115,20.45 115,24.45 112.75,26.7 v110.8,26.7 | 103.25,24.7 v103.25,23.05 | v66.8,49.75 67.8,48.75 v67.8,48.05
  Bottom 0.61: 85.8,20.45 89.1,20.45 91.31,22.9 93.1,24.7 v97.3,24.7 | 85.8,20.45 84.8,20.45 | 85.8,20.45 84.73,20.43 | 85.8,20.45 85,21.25 v85,22.05 | 85.8,20.45 79.35,20.45 77.55,22.25 v77.55,24.15 78.35,24.15 78.95,24.75 78.95,27.7 77.55,29.15 77.55,30.55 77.95,30.95 v77.95,36.15 | 36.6,50.25 v41,50.25 | v109.4,10.25 107.7,8.55 | 107.66,8.5 PCI.S53 | v115.95,42.44 115.95,42.6 | 60.05,12.85 v61.95,14.75 | 60.05,12.85 v61.95,12.85 | 60.05,12.85 56.8,12.85 v56,12.05 | PCI.S21 67.02,8.24 66.35,8.9 66.35,12.05 v66.65,12.35 | PCI.S27 74.64,8.07 74.4,8.3 74.4,12.3 v74.45,12.35 | v104.85,43.2 97.95,36.3 v95.3,36.3 | v42.6,25.86 42.6,25.9 43.6,26.9 55.6,26.9 v55.95,26.55 | v23.85,19.3 v23.85,22.65 | 91.7,64.4 v91.7,66.75 | 91.7,64.4 v94.1,64.4 | 91.7,64.4 91.7,57.65 88.6,54.55 v88.35,54.55 88.35,54.5 83.05,49.2 | v72.1,12.35 v72.11,12.35 72.12,12.34 72.12,9.53 v72.08,9.49 | v72.08,9.49 | v72.08,9.49 v72.1,9.49
  Bottom 0.813: 115.95,42.6 v115.95,46.9 | v29.1,50.25 36.6,50.25 36.6,54.55 | 36.6,54.55 v36.6,55.9 | 36.6,54.55 37.6,54.55 40.25,57.2 v43.15,57.2 | v82.05,48.25 82.75,48.9 83.05,49.2 v98.3,49.2 | v77.95,36.15 v77.95,46.05 | v115.95,42.44 115.95,34.75 110.8,29.6 v110.8,26.7 110.8,23.3 110.4,22.9 106.7,22.9 104.9,24.7 103.25,24.7 v97.3,24.7
3V3A  (via drill 0.6)
  Top 0.254: C66.+ 28.22,45.42 28.25,45.45 | C5.1 31.81,46.06 | C4.1 34.54,46.06 34.55,46.05 | C6.1 36.57,45.97 36.55,45.95 36.44,46.06 | v36.6,44.85 36.57,44.88 | DAC.12 33.13,35.98 31.95,34.8 30.6,34.8 30.35,35.05 v30.3,35.05 | DAC.31 27.08,32.98 27.55,33.45 v27.55,33.6 27.55,33.4 | DAC.30 26.57,33.48 27.1,32.95
  Top 0.61: 27.55,33.4 27.1,32.95 | v24.1,27.6 22.35,27.6 22.31,27.63 C1.1 20.69,27.66 20.67,27.68 20.68,27.68 C2.1
  Top 0.813: L1.1 C66.+ 31.17,45.42 31.81,46.06 | C5.1 C4.1 36.44,46.06 | 36.57,44.88 C6.1
  Bottom 0.254: 31.05,35.8 31.1,35.85
  Bottom 0.61: v27.55,33.6 27.55,35.05 28.3,35.8 31.05,35.8 | v27.55,33.6 | v27.55,33.6 27.55,31.05 v24.1,27.6
  Bottom 0.813: v30.3,35.05 31.1,35.85 36.6,41.35 v36.6,44.85
5V0  (via drill 0.6)
  Top 0.254: 17.95,22.66 17.95,22.65 18.14,22.65 | C51.1 19.1,43.52 | 93C46.8 49.21,69.81 48.35,68.95 48.35,65.2 45.55,62.4 42.35,62.4 R11.2 | FTDI.42 30.45,58.5 30.43,58.52 FTDI.3 24.33,58.52 24.33,58.57 22.34,60.56 R18.1 | 18.37,47.47 C65.+ | VGA.9 10.39,28.21 | VGA.9 | VGA.9 9.09,26.91 9.09,20.87 10.06,19.9 16.69,19.9 17.7,20.92 R9.2
  Top 0.406: R7.1 17.92,22.65 17.95,22.65 | R7.1 | R7.1 17.92,22.74
  Top 0.61: 18.89,21.9 R9.2 | v20.25,21.9 18.89,21.9 | 18.89,21.9 18.14,22.65 | 30.45,58.5 30.45,57.1 v28.95,55.6 | C51.1 19.05,44.45 18.37,45.13 C65.+ | C53.1 19.46,48.56 18.37,47.47 | 47.95,9 v50.5,9 | 47.95,9 v46.65,9 46.7,8.96 PCI.C5 | PCI.C6 47.97,8.99 47.95,9 | R11.2 39.47,62.38 v38.9,62.95 | C53.1 19.44,50.01 | v26.5,53.15 24.95,51.6 19.6,51.6 18.7,50.7 | v15.4,47.4 18.7,50.7 | C53.1 18.77,50.7 18.7,50.7
  Bottom 0.61: v26.5,53.15 v28.95,55.6 31.85,58.5 34.2,58.5 38.65,62.95 v38.9,62.95 | PCI.S8 v50.51,9 v50.5,9 | PCI.C5 46.7,8.96 v46.65,9 45.65,10 24.9,10 24.15,10.75 24.15,11.9 | 20.25,21.85 v20.25,21.9 20.25,17.05 | 24.15,11.9 24.15,16.25 23.35,17.05 20.25,17.05 | EXT1.12 24.13,11.88 24.15,11.9 | 20.25,17.05 19.75,17.05 13.39,10.68 5,10.68 2.55,13.13 2.55,38.87 11.07,47.39 15.42,47.39 v15.41,47.4 v15.4,47.4
+12V
  Bottom 0.61: PCI.S2 42.89,8.47 42.3,9.05 23.55,9.05 21.6,11 21.6,13.19 EXT1.13
-12V
  Top 0.61: PCI.C1 41.62,8.69 41,9.3 21.05,9.3 20.37,9.98 EXT1.14
GND  (via drill 0.6, 0.6 pad 0.25)
  Top 0.254: SDRAM.P$30 72.43,68.18 v72.85,68.6 73.43,68.02 SDRAM.P$32 | SDRAM.P$38 76.43,67.58 v77.4,68.55 | C57.2 117.45,13.45 117.47,13.43 | C77.2 119.48,13.58 | 113.42,38.72 CPLD.108 112.68,38.72 | 121.05,11.35 121.05,12.85 120.47,13.43 C77.2 | 121.05,11.35 121.05,11.3 | 106.9,46 106.85,46.05 104.75,46.05 104.5,46.3 103.44,46.3 C69.- 103.35,46.45 103.35,48.55 C61.- 106.35,51.55 109.7,51.55 2.5V.1 | 108.96,45.95 109,45.95 | 108.96,45.95 C76.2 109.1,45.81 109.1,45.75 114.3,45.75 | C11.2 106.95,45.95 108.96,45.95 | C11.2 107,46.06 | C62.- 113.51,45.75 114.3,45.75 | 92.86,21.2 CPLD.36 94.07,21.22 94.1,21.25 | 85.42,16.37 85.35,16.3 | 85.42,16.37 C36.2 83.72,16.37 83.65,16.3 C14.2 83.65,16.5 83.55,16.4 80.9,16.4 79.75,17.55 79.76,17.56 C35.2 77.8,17.6 77.75,17.65 C52.2 77.74,17.59 77.75,17.6 76.6,17.6 | 85.42,16.37 85.44,16.39 C37.2 89.24,16.39 | FPGA.P91 74.88,22.03 | 65.31,15.41 65.42,15.52 OSC.GND 65.45,15.55 65.31,15.41 | FPGA.P47 54.84,26.74 55.4,27.3 | FPGA.P41 54.14,29.74 54.15,29.75 54.9,29.75 55.4,29.25 55.4,27.3 | FPGA.P54 56.38,22.33 56.4,22.35 56.35,22.4 56.35,23.45 | FPGA.P59 58.88,23.22 58.65,23.45 57.1,23.45 | 22.93,14.4 EXT1.11 | C33.2 38.38,29.12 | 40.45,27.5 40.4,27.55 C19.2 40.31,27.59 | C33.2 38.84,29.11 | C32.2 35.88,29.12 34.52,30.48 DAC.1 34.08,30.48 32.94,29.34 DAC.48 32.94,29.86 32.65,30.15 28.9,30.15 | C33.2 38.79,29.11 | DAC.39 28.44,29.69 28.9,30.15 | DAC.38 27.94,29.89 28.18,30.13 | 28.18,30.13 28.25,30.2 28.55,30.2 | 28.9,30.15 28.85,30.15 28.8,30.2 28.55,30.2 | 28.18,30.13 28.1,30.2 27.7,30.2 | 27.7,30.2 27.65,30.2 27.44,29.99 DAC.37 | DAC.13 32.94,36.54 32.6,36.2 32.45,36.2
  Top 0.254: 27.44,36.56 DAC.24 | 31.95,36.2 27.8,36.2 27.44,36.56 | 31.95,36.2 32.45,36.2 | 32.45,36.2 32.45,36.25 32.44,36.26 DAC.14 | 31.95,36.2 31.95,36.3 31.94,36.31 DAC.15 | 27.44,36.56 27.36,36.56 26.78,35.98 DAC.25 26.57,35.98 27.3,35.25 27.3,34.95 | 27.3,34.95 27.3,34.6 27.2,34.5 | 27.3,34.95 27.25,34.95 27.22,34.98 DAC.27 | 27.2,34.5 27.9,34.5 28.55,33.85 28.55,30.2 | R3.1 | R1.1 16.5,36.25 R3.1 | 27.2,34.5 25.85,34.5 25.87,34.48 DAC.28 25.02,34.48 20.75,38.75 C51.2 | 16.54,34.16 16.5,34.2 R1.1 | 76.35,18.1 76.36,18.09 | 76.6,17.6 76.6,17.85 76.35,18.1 | 76.6,17.6 76.6,14.1 76.13,13.63 C30.1 75.55,13.65 C30.1 C72.1 71.79,15.35 71,15.35 C34.2 70.48,15.38 C64.- v67.6,14.13 66.98,14.13 66.21,13.36 C58.2 65.41,13.99 64.85,14.55 v64.5,14.55 | C23.2 59.85,12.95 | C23.2 59.85,13 59.98,12.88 | C23.2 59.85,13.1 59.84,13.09 C24.2 | C24.2 57.86,13.09 | FPGA.P118 82.04,30.74 v81.45,30.15 81.45,28.8 | 81.44,28.85 81.4,28.85 80.05,27.5 80.05,25.9 80.1,25.9 | 81.44,28.85 81.45,28.85 | 29.95,48.02 C66.- | 29.95,48.02 31.23,48.02 31.6,47.65 31.71,47.76 C5.2 34.19,47.76 34.2,47.75 34.21,47.76 C4.2 36.49,47.76 36.55,47.7 36.57,47.72 C6.2 36.33,47.78 36.3,47.75 37.85,47.75 42.37,43.23 C63.- 48.07,43.23 48.6,42.7 48.65,42.75 C22.2 | 48.75,44.8 48.65,44.9 | 48.75,44.8 C21.2 48.8,44.75 48.83,44.72 | C22.2 48.83,44.72 | 48.83,44.72 48.75,44.8 | C22.2 48.83,42.62 48.85,42.6 48.82,42.57 C20.2 48.82,40.63 48.85,40.6 48.81,40.56 C18.2 | C18.2 48.81,38.61 48.8,38.6 49.66,37.74 FPGA.P25 | v47.9,37.3 47.95,37.3 48.81,38.16 C18.2 | C13.2 87.52,39.48 v87.25,39.75 | C26.2 92.9,42.75 v92.95,42.7 | CPLD.144 94.52,40.72 v93.7,39.9
  Top 0.254: FPGA.P134 82.06,38.74 81.75,39.05 | C42.2 92,50 91.99,49.99 | C43.2 94.08,50.02 94.05,50.05 93.97,49.97 | C59.- 98.72,62.17 98.7,62.15 98.69,62.17 1.2V.4 98.61,64.19 97.4,65.4 95.55,65.4 | 95.55,65.4 95.45,65.4 | 95.45,65.4 95.47,65.42 C56.2 | 95.45,65.4 95.4,65.35 | 54.35,8.8 54.85,9.3 v56.65,9.3 59.4,9.3 | FTDI.47 27.95,61.95 28.35,62.35 28.55,62.35 28.95,61.95 FTDI.45 v28.95,59.75 | 86.58,23.98 86.2,23.6 86.23,23.57 C74.2 86.23,23.78 86.78,24.33 C25.2 | 77.55,25.45 v77.55,25.5 77.95,25.9 80.1,25.9 | FPGA.P105 81.86,24.24 80.68,25.43 | 80.1,25.9 80.2,25.9 80.68,25.43 | 88.1,24.2 88.13,24.23 C25.2 | 58.88,50.93 FPGA.P202 | 58.88,50.93 58.5,50.55 57.25,50.55 56.88,50.92 FPGA.P206 | C23.2 | 47.25,23.4 v47.3,23.4 47.42,23.28 55.47,23.28 55.63,23.13 | v8.95,53.9 8.95,54.65 8.39,55.21 USB.4 | R14.1 11.14,55.46 v10.1,56.5 | C54.1 v18.26,55.46 v18.25,55.45 | 16.28,59.57 v16.3,59.55 17.78,61.03 C50.1 | 29.95,48.02 FTDI.18 29.95,53.25 27.68,55.52 | 27.68,55.52 FTDI.9 | 27.68,55.52 27.68,56.42 v27.25,56.85 | FTDI.25 33.58,54.02 32.85,54.75 32.85,58.55 | 32.85,58.55 32.85,58.7 v31.75,59.8 | FTDI.34 32.88,58.52 32.85,58.55 | C45.2 50.05,55.45 | C3.2 50.1,55.5 C45.2 | 47.92,55.47 47.94,55.49 C44.2 | 47.92,55.47 C45.2 | 47.92,55.47 47.85,55.4 | C70.- 45.22,48.73 47.15,46.8 | FPGA.P14 52.41,43.24 51.9,43.75 v51.9,44.9 51.9,45.7 52.44,46.24 FPGA.P8 | FPGA.P1 52.49,49.74 v52,49.25 | 48.83,44.72 C27.2 | 48.83,44.72 48.85,44.7 | 47.15,46.8 v47.15,45.7 | C27.2 47.15,46.8 | C27.2 48.83,46.82 48.8,46.85 C46.2 48.8,49 48.83,49.03 C47.2 48.83,55.43 48.85,55.45 48.81,55.49 C44.2 | 83.95,47.25 83.94,47.24 FPGA.P151 82.25,47.24
  Top 0.254: C44.2 42.71,55.49 41.75,56.45 C55.2 41.9,57.2 41.79,57.21 C71.2 46.75,59.2 v52,64.45 52,64.85 93C46.5 | v55.4,28.4 55.4,27.3 | LED3.C 119.2,38.25 120,37.45 120,35.3 118.98,34.28 | 118.98,34.28 118.95,34.25 118.95,34 118.25,33.3 116.1,33.3 115.18,34.22 CPLD.99 112.69,34.22 112.68,34.24 112.65,34.24 | 118.98,34.28 LED2.C | 95.1,51.75 95.05,51.75 C29.2 | C28.2 98.15,52.91 v98.15,56.75 v101.2,56.75 | 86.3,64.6 86.3,64.66 C7.2 | C7.2 | 90.85,80.55 XCF04S.11 v90.85,78.75 | SDRAM.P$12 63.43,67.73 64.1,68.4 64.4,68.4 | SDRAM.P$14 64.43,68.38 64.42,68.38 64.4,68.4 | FPGA.P66 62.38,23.07 61.65,23.8 59.95,23.8 v57.25,26.5 | FPGA.P75 66.88,26.62 v64.35,29.15 | v90.85,78.75 90.6,79 84.7,79 83.75,79.95 | v90.85,78.75 XCF04S.10 90.85,74.4 92.51,72.74 R24.2 95.55,69.93 v95.55,69.9 95.55,65.45 | 58.88,50.93 58.88,50.52 59.65,49.75 61.5,49.75 62.5,48.75 v62.5,47.65 | FPGA.P195 62.38,50.42 64,48.8 67.2,48.8 68.1,49.7 v68.1,49.9 68.1,50.7 | FPGA.P179 70.38,50.88 70.2,50.7 68.1,50.7 | FPGA.P30 55.74,35.24 v56.05,35.55 56.4,35.9 59.4,35.9 v61.25,37.75 | 75.7,41.2 75.65,41.2 75.1,41.75 75.1,42.65 75.55,43.1 80.4,43.1 v81.55,44.25 | 75.7,41.2 79.65,41.2 v81.75,39.1 81.75,39.05 | FPGA.P170 74.88,50.07 76.15,48.8 | 76.15,47.05 76.15,46.65 77.6,45.2 79.55,45.2 81.25,46.9 81.25,46.91 81.59,47.24 82.25,47.24 | 76.15,47.05 76.15,48.8 | FPGA.P163 78.38,49.33 77.85,48.8 76.15,48.8 | FPGA.P157 81.38,50.53 80.3,49.45 80.1,49.45 77.7,47.05 76.15,47.05 | 106.9,46 C11.2 | v107.45,47.9 107.45,46.55 106.9,46 | CPLD.72 112.34,20.66 111,22 111,24.5 108.58,26.93 | CPLD.62 107.34,20.69 107.4,20.75 107.4,22.05 106.2,23.25 106.2,25.75
  Top 0.254: FPGA.P91 74.88,23.38 75.7,24.2 v75.7,26.65 | FPGA.P91 74.88,21.13 74.05,20.3 74.05,19.45 | 76.35,18.1 75,19.45 74.05,19.45 | 59.9,68.05 v60,68.05 60.43,67.57 SDRAM.P$6 | USB.4 | USB.4 7.18,55.17 7.2,55.15 7.18,55.13 USB.5 | 90.05,50.65 C17.2 89.69,49.99 88.6,48.9 v88.6,47.85 | 65.31,15.41 65.3,15.4 | 41.7,27 v41.7,26.75 | 59.4,9.3 59.4,12.59 C23.2 | 54.35,8.8 54.35,8.79 | 54.35,8.8 54.32,8.76 | 59.4,9.3 | 121.05,11.35 121.05,11.25 120.35,10.55 114.15,10.55 v113,9.4 | FPGA.P82 70.38,27.58 v70.4,27.6 | 87.89,24.33 88.14,24.23 | 87.89,24.33 C25.2 | 87.89,24.33 88.28,24.72 CPLD.29 94.07,24.72 94.1,24.75 | 112.65,29.7 112.65,29.71 | 112.65,29.7 112.65,29.64 113.07,29.22 CPLD.89 | 112.65,29.71 112.68,29.71 112.68,29.72 112.73,29.72 | 112.73,29.72 CPLD.90 | 112.73,29.72 112.73,29.71 | 112.68,38.72 112.68,38.71 112.65,38.68 112.65,34.24 | 112.65,29.71 112.65,34.24 | 81.44,28.85 81.44,28.8 | FPGA.P112 82.49,27.74 81.44,28.8 | FPGA.P186 66.88,50.87 67.05,50.7 68.1,50.7 | 105.35,41.84 105.36,41.86 | 105.35,41.84 105.34,41.84 105.75,42.25 v107.45,42.25 109.49,42.25 109.84,41.9 CPLD.114 109.84,39.81 110.94,38.72 112.68,38.72 | CPLD.123 105.34,41.84 105.35,41.84 | v81.55,44.25 82.24,44.25 82.25,44.24 82.25,47.24 | FPGA.P53 55.88,22.87 55.63,23.13 | C23.2 | C23.2 60.55,13.75 62.25,13.75 63.05,14.55 v64.5,14.55 | v64.5,14.55 64.8,14.55 65.31,15.06 65.31,15.41 | C49.1 29.47,70.68 v29.55,70.6 29.62,70.67 C48.1 | 93.9,21.05 94.1,21.25 | CPLD.18 93.68,30.22 94.1,29.8 | C73.1 73.5,18.9 74.05,19.45 | LED1.C 41.1,12.85 v39.75,14.2 37.75,16.2 25.45,16.2 | 56.35,23.45 55.95,23.45 55.63,23.13 | 56.35,23.45 56.8,23.45 | FPGA.P55 56.88,23.37 56.8,23.45
  Top 0.254: FPGA.P56 57.38,23.22 57.15,23.45 57.1,23.45 | 56.8,23.45 57.1,23.45 | 93C46.5 | 93C46.5 | R4.1 26.36,29.61 26.95,30.2 27.7,30.2 | 25.45,16.2 EXT1.9 | C24.2 57.9,13.2 | 57.9,13.05 C24.2 | 95.55,65.4 C56.2 | 95.55,65.45 95.55,65.4 | 95.55,65.45 C56.2 | C7.2 87.01,65.45 95.55,65.45 | 119.5,13.5 119.5,13.45 C77.2 | 121.95,29.65 121.95,29.45 | 25.45,16.2 23.55,16.2 22.95,15.6 22.95,14.45 EXT1.11 | EXT1.11 22.9,14.4 | 114.3,45.75 119.5,45.75 v120.4,44.85 | C7.2 | FPGA.P129 82.41,36.24 81.75,36.9 81.75,39.05 | v75.7,37.8 75.7,41.2 | v23,48.85 21.85,50 C53.2 21.16,48.16 20.97,47.97 C65.- 20.97,44.72 20.75,44.5 C51.2 | C7.2 84.44,64.71 v84.1,65.05 84.63,64.52 C40.2 84.6,60.5 85.23,60.5 C41.2 86.33,59.5 87.6,59.5 88.9,60.8 C15.2 | C15.2 89.33,62.13 v89.75,62.55 | C15.2 89.35,60.8 | FPGA.P145 v81.56,44.24 v81.55,44.25 | 108.58,26.93 111.35,29.7 112.65,29.7 | 81.45,28.8 | 81.44,28.8 81.45,28.8 | 94.1,29.8 95.2,29.8 v95.65,29.35 | 94.1,21.25 94.1,24.75 | 94.1,24.75 94.1,25.75 | 94.1,25.75 94.1,29.8 | CPLD.47 v99.84,22.09 v99.85,22.1 99.85,25.75 | FPGA.P99 78.88,23.63 v80.05,24.8 80.68,25.43 | 94.1,25.75 99.85,25.75 | 108.58,26.93 107.4,25.75 106.2,25.75 | 99.85,25.75 106.2,25.75 | v57.5,75.75 57.93,76.18 SDRAM.P$86 57.93,79.35 | v58.65,80.3 58.3,80.3 57.93,79.93 57.93,79.35 | 57.93,79.35 58.5,79.35 58.93,78.92 SDRAM.P$84 | 57.93,79.35 57.7,79.35 55.68,81.37 C67.- | 72.45,79.5 71.93,78.98 SDRAM.P$58 71.93,76.18 71.65,75.9 71.65,74.3 71.3,73.95 71.3,72.95 v71.33,72.93 70.03,72.93 67.1,70 66,70 64.4,68.4 | SDRAM.P$57 72.43,79.48 72.45,79.5 | 67.65,81.95 C8.2 67.67,80.42 67.65,80.4 | SDRAM.P$70 65.93,78.88 66.4,79.35 66.43,79.35
  Top 0.254: v79.5,80.4 79,80.4 78.45,79.85 | SDRAM.P$46 77.93,79.33 78.45,79.85 | SDRAM.P$44 78.93,79.37 78.45,79.85 | v76.7,80.4 76.25,80.4 74.93,79.08 SDRAM.P$52 | C9.2 v72.84,80.41 v72.85,80.4 | 72.45,79.5 72.85,79.9 v72.85,80.4 | SDRAM.P$72 64.93,78.87 64.45,79.35 | SDRAM.P$73 64.43,79.33 64.45,79.35 | 64.45,79.35 64.45,80.1 65,80.65 66.2,80.65 66.45,80.4 | v72.85,80.4 67.65,80.4 | 67.65,80.4 66.45,80.4 | 66.43,79.35 66.43,80.38 66.45,80.4 | 66.43,79.35 SDRAM.P$69 | SDRAM.P$78 61.93,79.88 v62.38,80.33 63.16,81.11 C10.2 | R2.1 16.41,38.34 16.45,38.3 R3.1 | v12.85,34.47 12.45,34.08 7.16,34.08 2.5,29.42 2.5,15.21 v8.47,9.24 v8.48,9.24 | v12.85,34.47 | C51.2 | R1.1 16.51,34.28 | R1.1 | v12.85,34.47 13.06,34.28 R1.1
  Top 0.61: C32.2 38.38,29.12 | 40.4,27.55 41.15,27.55 41.7,27 | 38.79,29.11 40.31,27.59 | C42.2 93.97,49.97 | 89.24,16.39 93.9,21.05 | 90.05,50.65 89.85,50.85 C60.- | C17.2 91.99,49.99 | 59.4,9.3 PCI.C15 | 54.32,8.76 PCI.C11 | v68.1,49.9 68.1,50.5 | PCI.C17 61.94,8.58 v63.21,9.85 | PCI.C22 68.29,8.42 v67.4,9.3 | 121.35,27.6 121.35,28.85 121.95,29.45 | 121.35,27.6 121.35,22.15 120.82,21.62 C75.2 120.2,21.6 120.19,21.59 C68.- 121.03,19.37 121.5,18.9 121.5,15.5 119.5,13.5 | 121.35,27.6 C12.2 | 121.95,29.65 121.95,43.3 121.16,44.09 v120.4,44.85 | C57.2 117.7,13.4 117.73,13.43 C77.2 | 57.9,13.05 57.3,13.65 53.8,13.65 52.1,11.95 46.24,11.95 LED1.C | 42.24,22.49 42.23,22.48 C39.1 | 42.24,22.49 C16.1 | 42.24,22.49 42.25,22.5 44.15,22.5 | 44.15,22.5 46.4,22.5 v47.3,23.4 | 44.15,22.5 44.16,22.49 C38.1 | C29.2 95.04,51.74 95.05,51.75 C29.2 | C29.2 C31.2 | C29.2 94.95,51.7 | C29.2 | C29.2 | C29.2 | 94.08,50.02 95,50.94 C29.2 | C28.2 95.1,51.75 | 102.9,82.05 v102.85,82.05 v98.45,82.05 | PCI.C57 112.74,9.13 v113,9.4
  Bottom 0.254: v72.85,68.6 72.85,71.35 v71.33,72.93 71.3,72.95 71.3,75.15 72,75.85 76.75,75.85 77.4,75.2 v77.4,72 v77.4,68.55 | 56.6,28.3 56.1,27.8 56.1,27.65 v57.25,26.5 | v92.95,42.7 92.95,40.7 93.75,39.9 v93.7,39.9 93.7,39.95 93.5,39.75 v87.25,39.75 82.15,39.75 81.8,39.4 81.8,39.1 v81.75,39.1 | EXT1.11 22.93,14.42 22.95,14.4 22.95,15.55 22.3,16.2 20.5,16.2 13.54,9.24 v8.48,9.24 | v8.95,53.9 8.95,55.35 v10.1,56.5 11.15,55.45 16.3,55.45 | 16.3,55.45 v18.25,55.45 | 16.3,55.45 16.3,58.5 | 16.3,58.5 v16.3,59.55 | 16.3,55.45 16.3,55 22.45,48.85 v23,48.85 | 16.3,58.5 20.8,58.5 | 20.8,58.5 27.25,58.5 | 27.25,58.5 27.7,58.5 v28.95,59.75 28.9,59.75 28.95,59.8 v31.75,59.8 | 27.25,58.5 v27.25,56.85 | 20.8,58.5 20.8,60.9 29.55,69.65 v29.55,70.6 | 52,45.7 52,44.95 51.9,44.85 v51.9,44.9 51.9,45.6 52,45.7 | 52,45.7 v52,49.25 | v47.15,45.7 52,45.7 | 56.6,28.3 55.5,28.3 v55.4,28.4 43.35,28.4 v41.7,26.75 41.7,24.3 | v79.5,80.4 v76.7,80.4 v72.85,80.4 72.6,80.65 62.75,80.65 62.4,80.3 | v64.35,29.15 57.45,29.15 56.6,28.3 | 62.4,80.3 v62.38,80.32 v62.38,80.33 62.4,80.31 62.4,80.3 | v58.65,80.3 62.4,80.3 | v107.45,42.25 v107.45,47.9 | v77.55,25.5 76.4,26.65 v75.7,26.65 75.7,27.6 | 75.7,27.6 v75.7,37.8 | 75.7,27.6 v70.4,27.6 | v88.6,47.85 88.6,47.2 85.65,44.25 v81.55,44.25 80.6,44.25 80.05,44.8 80.05,48.8 89.75,58.5 v89.75,62.55 89.75,66.75 90.7,67.7 92.6,67.7 98.15,62.15 v98.15,56.75 | v60,68.05 60,68.7 60.4,69.15 60.4,70.75 57.25,73.9 | 111.47,7.86 PCI.S56 | v63.21,9.85 64.3,10.95 64.3,14.35 v64.5,14.55 | v68.1,49.9 68.1,50.25 67.65,50.7 63.35,50.7 62.8,50.15 62.8,47.95 v62.5,47.65 62.85,47.3 62.85,39.35 v61.25,37.75
  Bottom 0.254: v67.4,9.3 67.4,11.5 67.75,11.85 67.75,14 67.62,14.13 v67.6,14.13 | v101.2,56.75 101.2,64.25 v95.55,69.9 | v47.9,37.3 49.65,35.55 v56.05,35.55 | v84.1,65.05 84.1,69 80.85,72.25 | v81.45,30.15 94.85,30.15 v95.65,29.35 | 57.25,73.9 57.25,75.5 v57.5,75.75 | v52,64.45 52,68.65 57.25,73.9 | VGA.6 | VGA.6 VGA.7 | VGA.6 10.36,21.33 | VGA.7 VGA.8 10.39,25.92 9.17,27.14 9.17,29.61 10.04,30.48 VGA.10 | VGA.7 10.36,23.61 | VGA.10 10.39,30.47 11.54,31.63 VGA.5 12.91,34.41 v12.85,34.47 | VGA.10 | v12.85,34.47 | v12.85,34.47 | v8.48,9.24 v8.47,9.24 | v8.48,9.24
  Bottom 0.61: v47.3,23.4 42.6,23.4 41.7,24.3 | v63.21,9.85 PCI.S18 | v120.4,44.85 120.4,64.5 v102.85,82.05 | v90.85,78.75 94.15,82.05 v98.45,82.05 | v113,9.4 112.4,9.4 111.47,8.46 111.47,7.86
  pour Bottom (isolate 0.305): 0.05,86 123,86.05 123,8.25 15.25,8.25 15.25,0 0.05,0
  pour Top (isolate 0.305): 0.05,86 123,86.05 123,8.25 15.25,8.25 15.25,0 0.05,0
N$1
  Top 0.254: R27.2 118.77,41.03 118.3,41.5 116.45,41.5 115.8,40.85 115.8,38.65 115.37,38.22 CPLD.107
N$2  (via drill 0.6 pad 0.25)
  Top 0.254: CPLD.39 95.84,21.34 v96.05,21.55
  Bottom 0.254: 59.4,8.79 62.8,12.2 62.8,15.85 64.1,17.15 70.1,17.15 72.1,19.15 93.7,19.2 v96.05,21.55
  Bottom 0.61: PCI.S15 59.4,8.79
N$3
  Top 0.254: 88.7,13.1 88.75,13.1 | 88.7,13.1 89.7,13.1 94.1,17.5 95.45,17.5 96.34,18.39 CPLD.40 | 88.7,13.1 79.2,13.1 77.05,10.95 66.7,10.95 65.85,10.1 | 65.85,10.1 65.8,10.05 | PCI.C20 65.75,9.99 65.85,10.1
N$4  (via drill 0.6 pad 0.25)
  Top 0.254: v97.3,21.7 97.3,21.05 96.84,20.59 CPLD.41
  Bottom 0.254: 92.9,18.55 92.75,18.55 | 92.9,18.55 72.4,18.55 70.4,16.55 67.3,16.55 66,15.25 66,13.35 65.5,12.85 65.5,8.55 65.75,8.3 65.75,8.29 PCI.S20 | 92.9,18.55 95.3,18.55 97.3,20.6 v97.3,21.7
N$5
  Top 0.254: CPLD.43 97.84,18.44 97.5,18.1 96.9,18.1 95.65,16.85 94.35,16.85 90.05,12.55 79.55,12.55 77.4,10.4 67.15,10.4 66.45,9.7 66.45,8.85 67.02,8.29 PCI.C21
N$6  (via drill 0.6 pad 0.25)
  Top 0.254: CPLD.44 98.34,20.14 v98.95,20.8
  Bottom 0.254: 93.9,17.95 93.2,17.95 | 93.9,17.95 72.7,17.95 68.5,13.75 68.5,11.45 68.29,11.23 PCI.S22 | 93.9,17.95 95.65,17.95 98.5,20.8 v98.95,20.8
N$7  (via drill 0.6 pad 0.25)
  Top 0.254: CPLD.45 98.84,18.24 v98.35,17.75 | PCI.C23 69.56,9 v69.15,9.4
  Bottom 0.254: 93.1,17.35 92.9,17.35 | 93.1,17.35 73.05,17.35 69.15,13.45 v69.15,9.4 | 93.1,17.35 96.15,17.35 96.75,17.95 98.15,17.95 v98.35,17.75
N$8  (via drill 0.6 pad 0.25)
  Top 0.254: CPLD.46 99.34,17.44 98.75,16.85 97.41,16.85 v97.15,17.1
  Bottom 0.254: 70,11.9 70,8.5 69.56,8.05 PCI.S23 | 70,11.9 70,12.05 | 70,11.9 70,13.35 70.2,13.55 71.8,15 73.6,16.8 96.85,16.8 v97.15,17.1
N$9  (via drill 0.6 pad 0.25)
  Top 0.254: CPLD.48 100.34,20.24 v100.85,20.75 | v70.85,9.5 70.85,9.45 70.83,9.42 PCI.C24
  Bottom 0.254: v100.85,20.75 100.85,18.95 98.1,16.2 73.85,16.2 70.85,13.2 v70.85,9.5
N$10  (via drill 0.6 pad 0.25)
  Top 0.254: CPLD.49 100.84,17.64 v100.45,17.25
  Bottom 0.254: PCI.S25 72.1,7.93 72.95,8.79 72.95,13.31 75.25,15.6 75.3,15.65 98.85,15.65 v100.45,17.25
N$11
  Top 0.254: CPLD.50 101.34,16.89 100.65,16.2 94.65,16.2 90.45,12 79.9,12 77.75,9.85 74.3,9.85 73.5,9.05 | 73.5,9.05 73.4,8.94 | PCI.C26 73.37,8.91 73.5,9.05
N$12  (via drill 0.6 pad 0.25)
  Top 0.254: CPLD.51 101.84,16.59 100.9,15.65 95.3,15.65 v94.45,14.8
  Bottom 0.254: v94.45,14.8 94.3,14.65 75.36,14.7 73.55,12.89 73.55,8.55 73.37,8.36 PCI.S26
N$13
  Top 0.254: 77.35,8.55 77.2,8.4 | 77.35,8.55 80.25,11.45 90.75,11.45 93.25,13.95 101.43,13.95 103.34,15.86 CPLD.54 | PCI.C29 77.18,8.37 77.35,8.55
N$14  (via drill 0.6 pad 0.25)
  Top 0.254: v95.7,14.8 101.3,14.8 102.34,15.84 CPLD.52 | 74.64,8.54 75.1,9 v75.5,9 75.1,9 74.64,8.53 PCI.C27